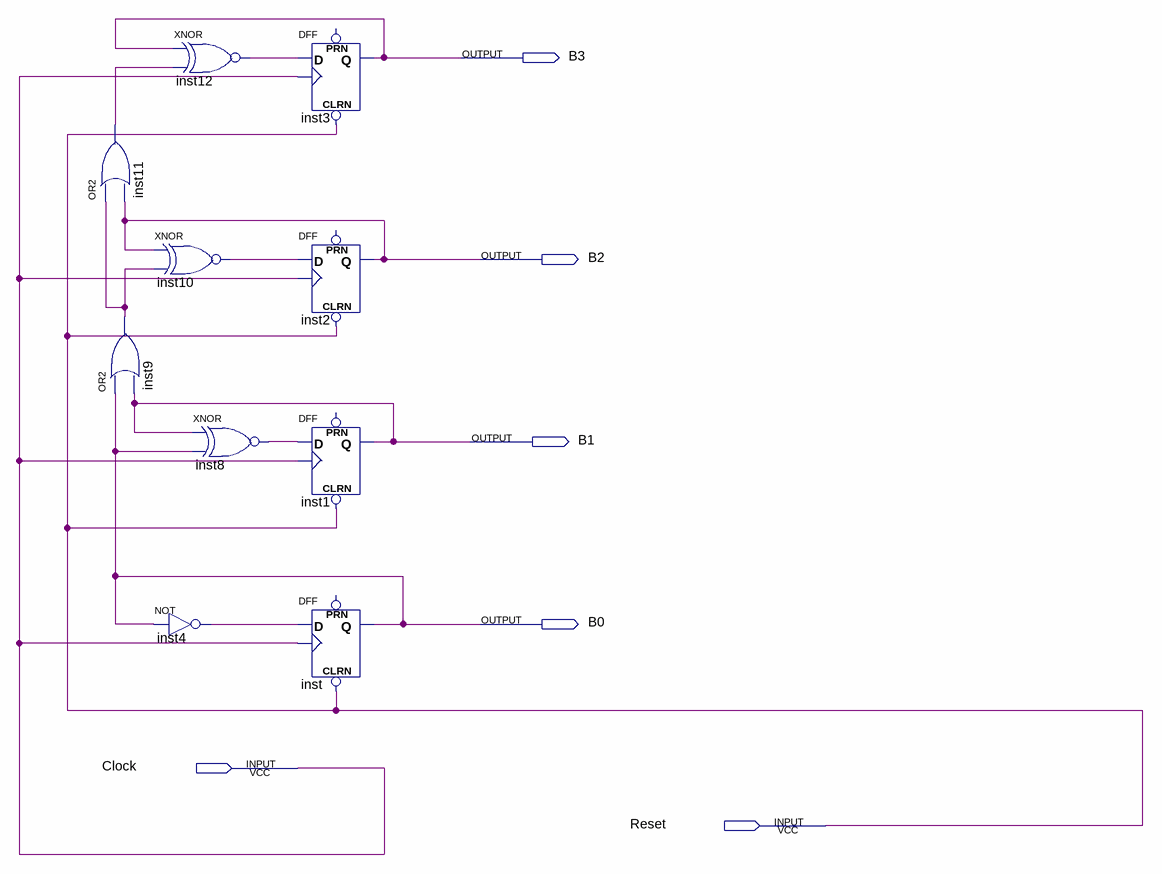
[diagram p0: schematic sheet]
// Quartus schematic count_down_schem_new.bdf as structural Verilog: 10 symbols, 6 pins
module count_down_schem_new (
  input  Clock,
  input  Reset,
  output B3,
  output B2,
  output B1,
  output B0
);

  wire inst4_out, inst8_out, inst9_out, inst10_out, inst11_out, inst12_out;

  or inst11 (inst11_out, inst9_out, B2);
  or inst9 (inst9_out, B0, B1);
  xnor inst12 (inst12_out, B3, inst11_out);
  xnor inst10 (inst10_out, B2, inst9_out);
  xnor inst8 (inst8_out, B1, B0);
  not inst4 (inst4_out, B0);
  DFF inst3 (.CLRN(Reset), .CLK(Clock), .D(inst12_out), .Q(B3));  // open: PRN
  DFF inst2 (.CLRN(Reset), .CLK(Clock), .D(inst10_out), .Q(B2));  // open: PRN
  DFF inst1 (.CLRN(Reset), .CLK(Clock), .D(inst8_out), .Q(B1));  // open: PRN
  DFF inst (.CLRN(Reset), .CLK(Clock), .D(inst4_out), .Q(B0));  // open: PRN
endmodule
